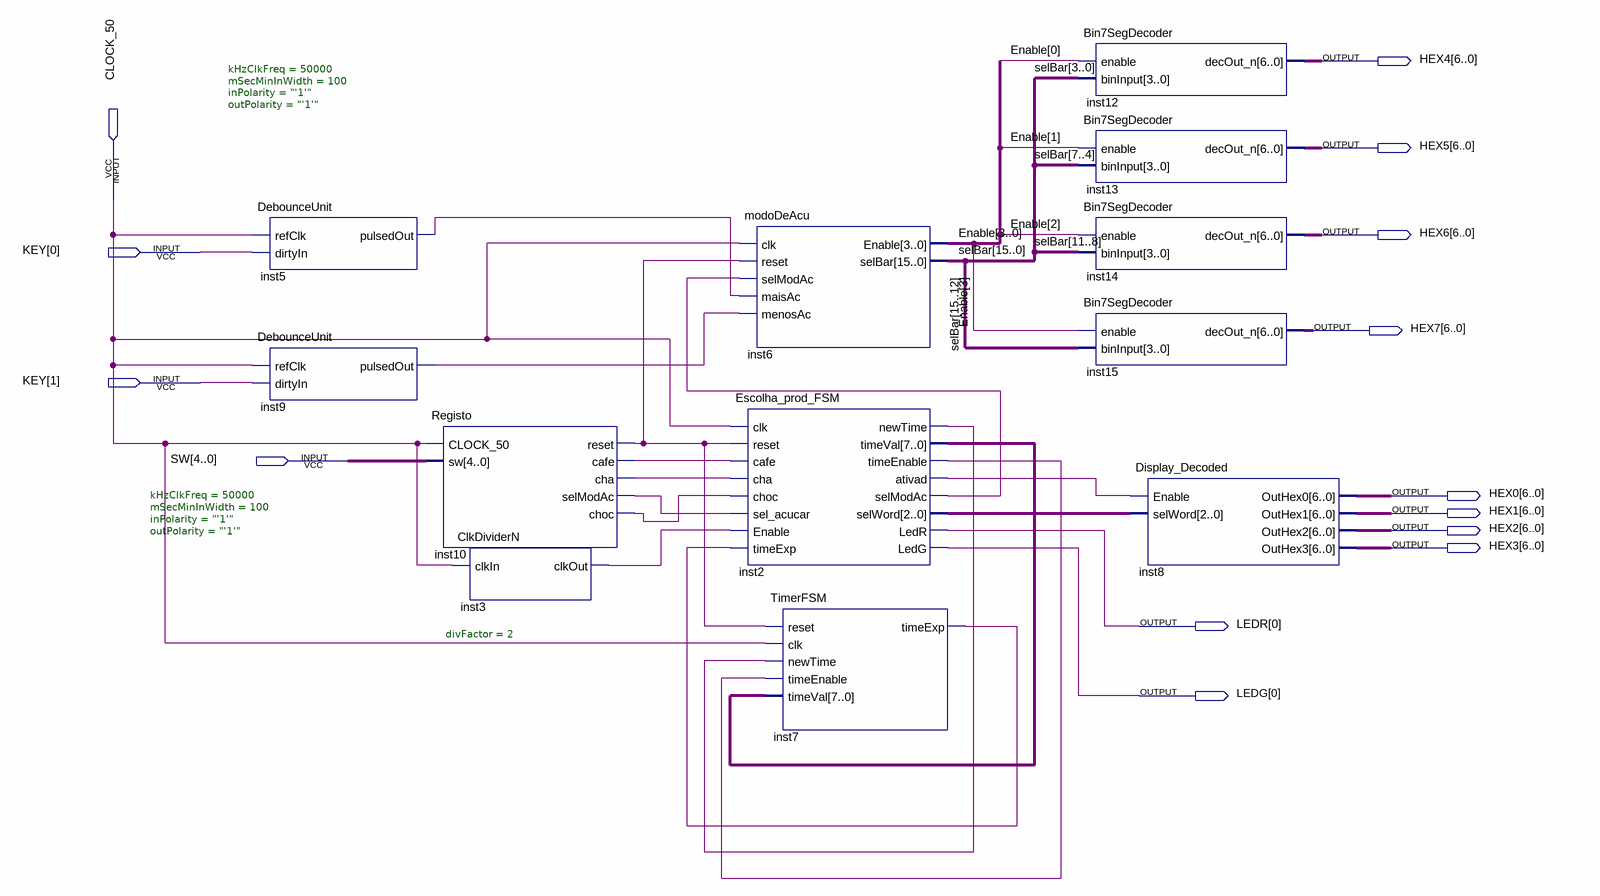
[diagram p0: schematic sheet]
// Quartus schematic ModoDeAcucarDemo.bdf as structural Verilog: 12 symbols, 14 pins
module ModoDeAcucarDemo (
  input  CLOCK_50,
  input  [1:0] KEY,
  input  [4:0] SW,
  output [6:0] HEX4,
  output [6:0] HEX5,
  output [6:0] HEX6,
  output [6:0] HEX7,
  output [6:0] HEX0,
  output [6:0] HEX1,
  output [6:0] HEX2,
  output [6:0] HEX3,
  output [0:0] LEDR,
  output [0:0] LEDG
);

  wire inst2_ativad, inst2_newtime, inst2_selmodac, inst2_timeenable, inst3_clkout, inst5_pulsedout,
       inst7_timeexp, inst9_pulsedout, inst10_cafe, inst10_cha, inst10_choc, inst10_reset, inst10_selmodac;
  wire [2:0] inst2_selword;
  wire [3:0] Enable;
  wire [7:0] inst2_timeval;
  wire [15:0] selBar;

  DebounceUnit #(.kHzClkFreq(50000), .mSecMinInWidth(100), .inPolarity("'1'"), .outPolarity("'1'")) inst5 (
    .refClk(CLOCK_50), .dirtyIn(KEY[0]), .pulsedOut(inst5_pulsedout));
  DebounceUnit #(.kHzClkFreq(50000), .mSecMinInWidth(100), .inPolarity("'1'"), .outPolarity("'1'")) inst9 (
    .refClk(CLOCK_50), .dirtyIn(KEY[1]), .pulsedOut(inst9_pulsedout));
  Registo inst10 (
    .CLOCK_50(CLOCK_50), .sw(SW), .reset(inst10_reset), .cafe(inst10_cafe), .cha(inst10_cha),
    .selModAc(inst10_selmodac), .choc(inst10_choc));
  ClkDividerN #(.divFactor(2)) inst3 (.clkIn(CLOCK_50), .clkOut(inst3_clkout));
  modoDeAcu inst6 (
    .clk(CLOCK_50), .reset(inst10_reset), .selModAc(inst2_selmodac), .maisAc(inst5_pulsedout),
    .menosAc(inst9_pulsedout), .Enable(Enable), .selBar(selBar));
  Escolha_prod_FSM inst2 (
    .clk(CLOCK_50), .reset(inst10_reset), .cafe(inst10_cafe), .cha(inst10_cha), .choc(inst10_choc),
    .sel_acucar(inst10_selmodac), .Enable(inst3_clkout), .timeExp(inst7_timeexp), .newTime(inst2_newtime),
    .timeVal(inst2_timeval), .timeEnable(inst2_timeenable), .ativad(inst2_ativad), .selModAc(inst2_selmodac),
    .selWord(inst2_selword), .LedR(LEDR[0]), .LedG(LEDG[0]));
  TimerFSM inst7 (
    .reset(inst10_reset), .clk(CLOCK_50), .newTime(inst2_newtime), .timeEnable(inst2_timeenable),
    .timeVal(inst2_timeval), .timeExp(inst7_timeexp));
  Bin7SegDecoder inst12 (.enable(Enable[0]), .binInput(selBar[3:0]), .decOut_n(HEX4));
  Bin7SegDecoder inst13 (.enable(Enable[1]), .binInput(selBar[7:4]), .decOut_n(HEX5));
  Bin7SegDecoder inst14 (.enable(Enable[2]), .binInput(selBar[11:8]), .decOut_n(HEX6));
  Bin7SegDecoder inst15 (.enable(Enable[3]), .binInput(selBar[15:12]), .decOut_n(HEX7));
  Display_Decoded inst8 (
    .Enable(inst2_ativad), .selWord(inst2_selword), .OutHex0(HEX0), .OutHex1(HEX1), .OutHex2(HEX2),
    .OutHex3(HEX3));
endmodule
